# EAGLE design 1234-holes (EAGLE 8.3.0)
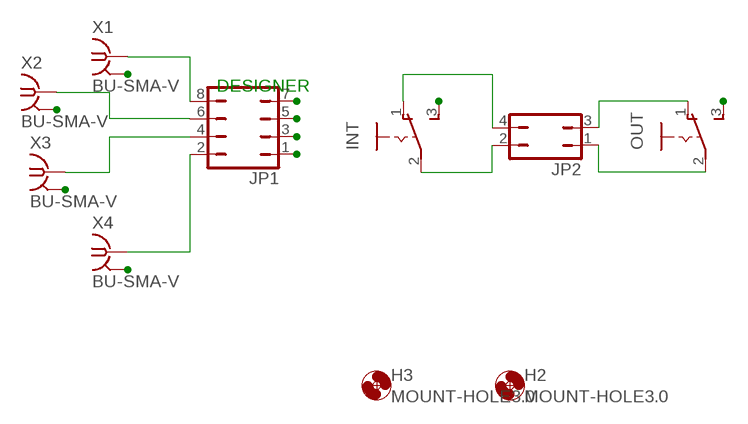
[diagram p0: schematic, sheet 1]

## Parts
H2  MOUNT-HOLE3.0  [3,0]
H3  MOUNT-HOLE3.0  [3,0]
INT  255SB  [255SB]
JP1  JP4Q  [JP4Q]
JP2  JP2Q  [JP2Q]
OUT  255SB  [255SB]
X1  BU-SMA-V  [BU-SMA-V]
X2  BU-SMA-V  [BU-SMA-V]
X3  BU-SMA-V  [BU-SMA-V]
X4  BU-SMA-V  [BU-SMA-V]

## Nets
GND: INT.3(S) JP1.1 JP1.3 JP1.5 JP1.7 OUT.3(S) X1.2 X1.3 X1.4 X1.5 X2.2 X2.3 X2.4 X2.5 X3.2 X3.3 X3.4 X3.5 X4.2 X4.3 X4.4 X4.5
N$1: INT.2(P) JP2.2
N$2: JP1.8 X1.1
N$3: JP1.6 X2.1
N$4: INT.1(O) JP2.4
N$5: JP1.4 X3.1
N$8: JP1.2 X4.1
N$9: JP2.1 OUT.2(P)
N$10: JP2.3 OUT.1(O)

## Notes on the sheet
- DESIGNER

## Library data of the parts
H2 H3 = holes:MOUNT-HOLE: MOUNTING HOLE with drill center marker
INT OUT = switch:255SB: SLIDING SWITCH Distributor Buerklin, 11G810
JP1 = jumper:JP4Q: JUMPER
JP2 = jumper:JP2Q: JUMPER
X1-X4 = con-coax:BU-SMA-V: FEMALE SMA CONNECTOR Radiall distributor RS 112-3794; OC_FARNELL: unknown; OC_NEWARK: unknown

## Board
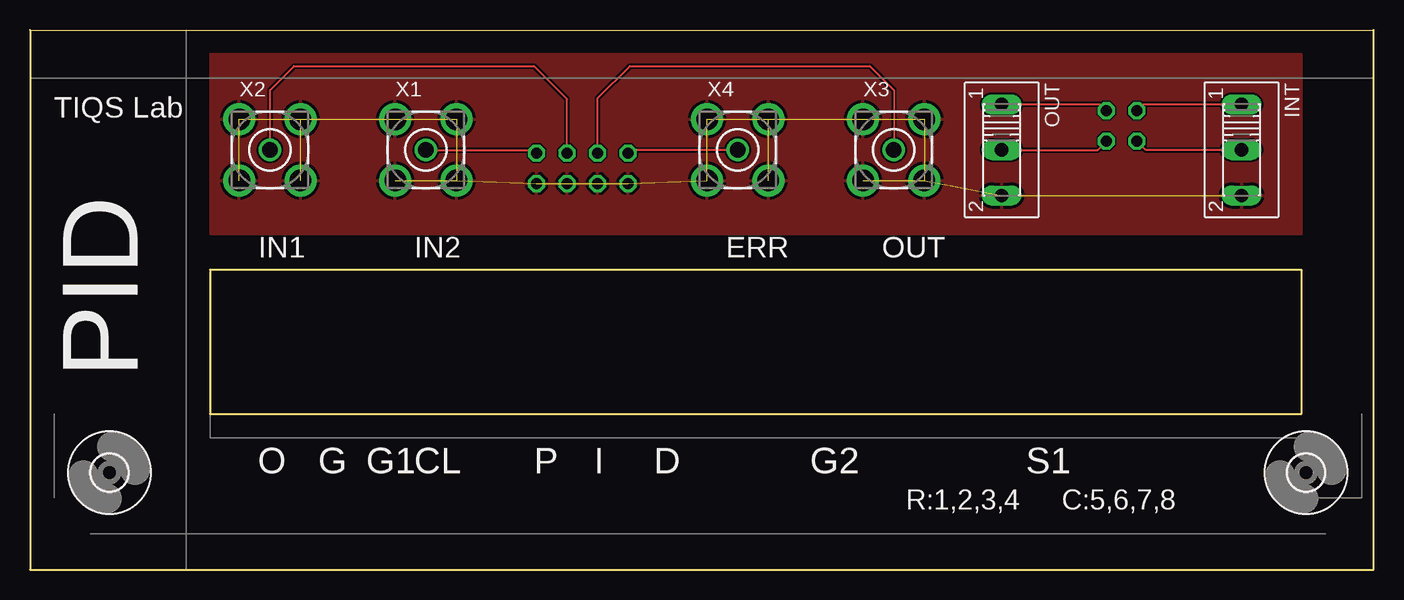
[diagram p1: board, top side]
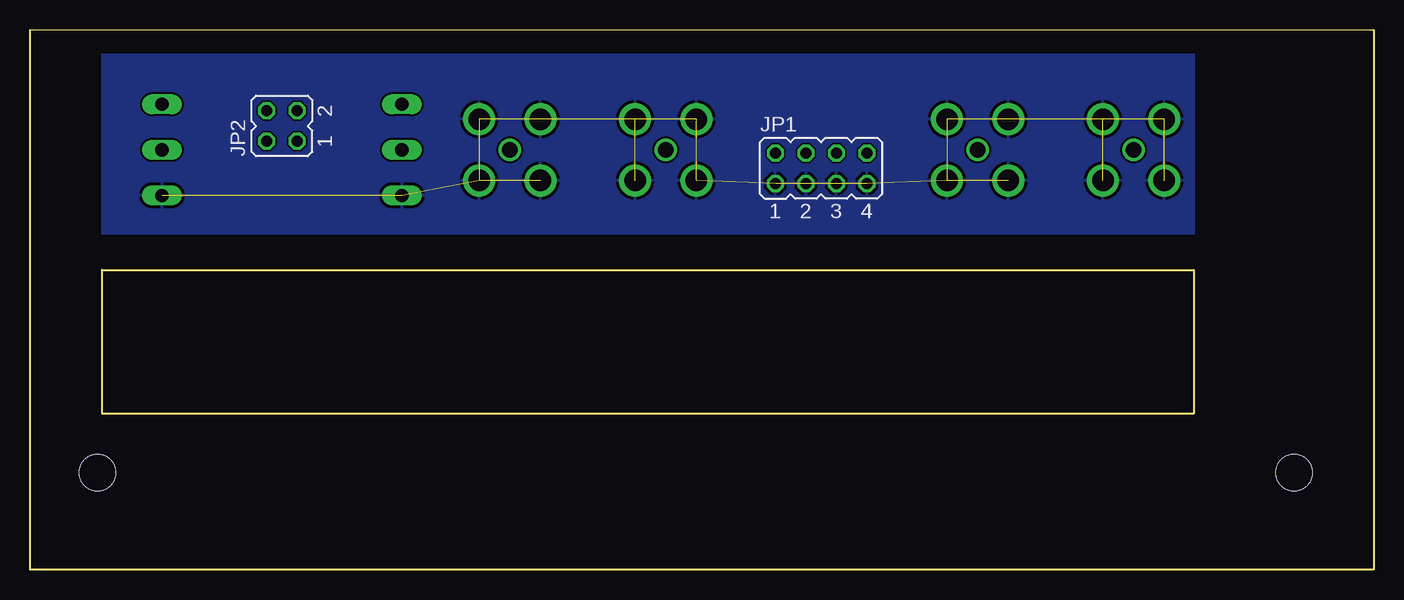
[diagram p2: board, bottom side, seen from below]

Size 112 x 45 mm. Coordinates in mm from the lower left corner, seen from the top.
Outline: 0,45 0,0 112,0 112,45 0,45
Outline: 15,25 15,13 106,13 106,25 15,25
Copper layers (1*16): Top 0.035mm / dielectric 1.5mm / Bottom 0.035mm
Design rules "default": minimum track width 6mil, minimum drill 0.35mm, track to track 6mil, track to pad 6mil, pad to pad 6mil, via to via 6mil, smd to smd 6mil, copper to edge 40mil, drill to drill 6mil, minimum pad ring 10mil, minimum via ring 8mil, stop-mask expansion 4mil, vias tented up to drill 0mil, thermal gap 10mil

### Footprints (pad centres in the part's own frame; a part is rotated, then mirrored left to right if it is on the bottom)
3,0 = hole 3: 0,0
255SB = drill 1.118 long: 1 -3.81,0; 2 0,0; 3 3.81,0
JP4Q = drill 0.914 octagon: 1 -3.81,-1.27; 2 -3.81,1.27; 3 -1.27,-1.27; 4 -1.27,1.27; 5 1.27,-1.27; 6 1.27,1.27; 7 3.81,-1.27; 8 3.81,1.27
JP2Q = drill 0.914 octagon: 1 -1.27,-1.27; 2 -1.27,1.27; 3 1.27,-1.27; 4 1.27,1.27
BU-SMA-V = drill 1.27: 1 0,0 | drill 1.778: 2 -2.55,2.55; 3 2.55,2.55; 4 2.55,-2.55; 5 -2.55,-2.55

### Placement (x,y rotation side)
H2  106.37,8.08 0 top
H3  6.62,8.08 0 top
INT  101,35 270 top
JP1  46.05,33.47 0 bottom
JP2  91,37 90 bottom
OUT  81,35 270 top
X1  33,35 0 top
X2  20,35 0 top
X3  72,35 0 top
X4  59,35 0 top

### Tracks (layer width: path | path; a pad name or v marks a point on that pad's centre or on a via)
GND  (21 unrouted)
  pour Top: 15,43 15,28 106,28 106,43
  pour Bottom: 15,43 15,28 106,28 106,43
N$1
  Top 0.152: INT.2 93,35 JP2.2
N$2
  Top 0.152: X1.1 41.98,35 JP1.8
N$3
  Top 0.152: X2.1 20,40 22,42 42,42 44.78,39.22 JP1.6
N$4
  Top 0.152: JP2.4 92.81,38.81 INT.1
N$5
  Top 0.152: JP1.4 47.32,39.32 50,42 70,42 72,40 X3.1
N$8
  Top 0.152: X4.1 50.13,35 JP1.2
N$9
  Top 0.152: OUT.2 89,35 JP2.1
N$10
  Top 0.152: OUT.1 89.19,38.81 JP2.3

### Text on the board
tPlace: TIQS Lab | IN1 | IN2 | ERR | OUT | PID | O | G | G1 | CL | P | I | D | G2 | S1 | R:1,2,3,4 | C:5,6,7,8